# EAGLE design 04A-005 (EAGLE 9.6.2)
CIRCUIT_CATEGORY: CIRCUIT CATEGORY; CIRCUIT_VARIANT: CIRCUIT CATEGORY; LINE1: PRINTED CIRCUIT BOARD; LINE3: VARIANT; TITLE: TITLE
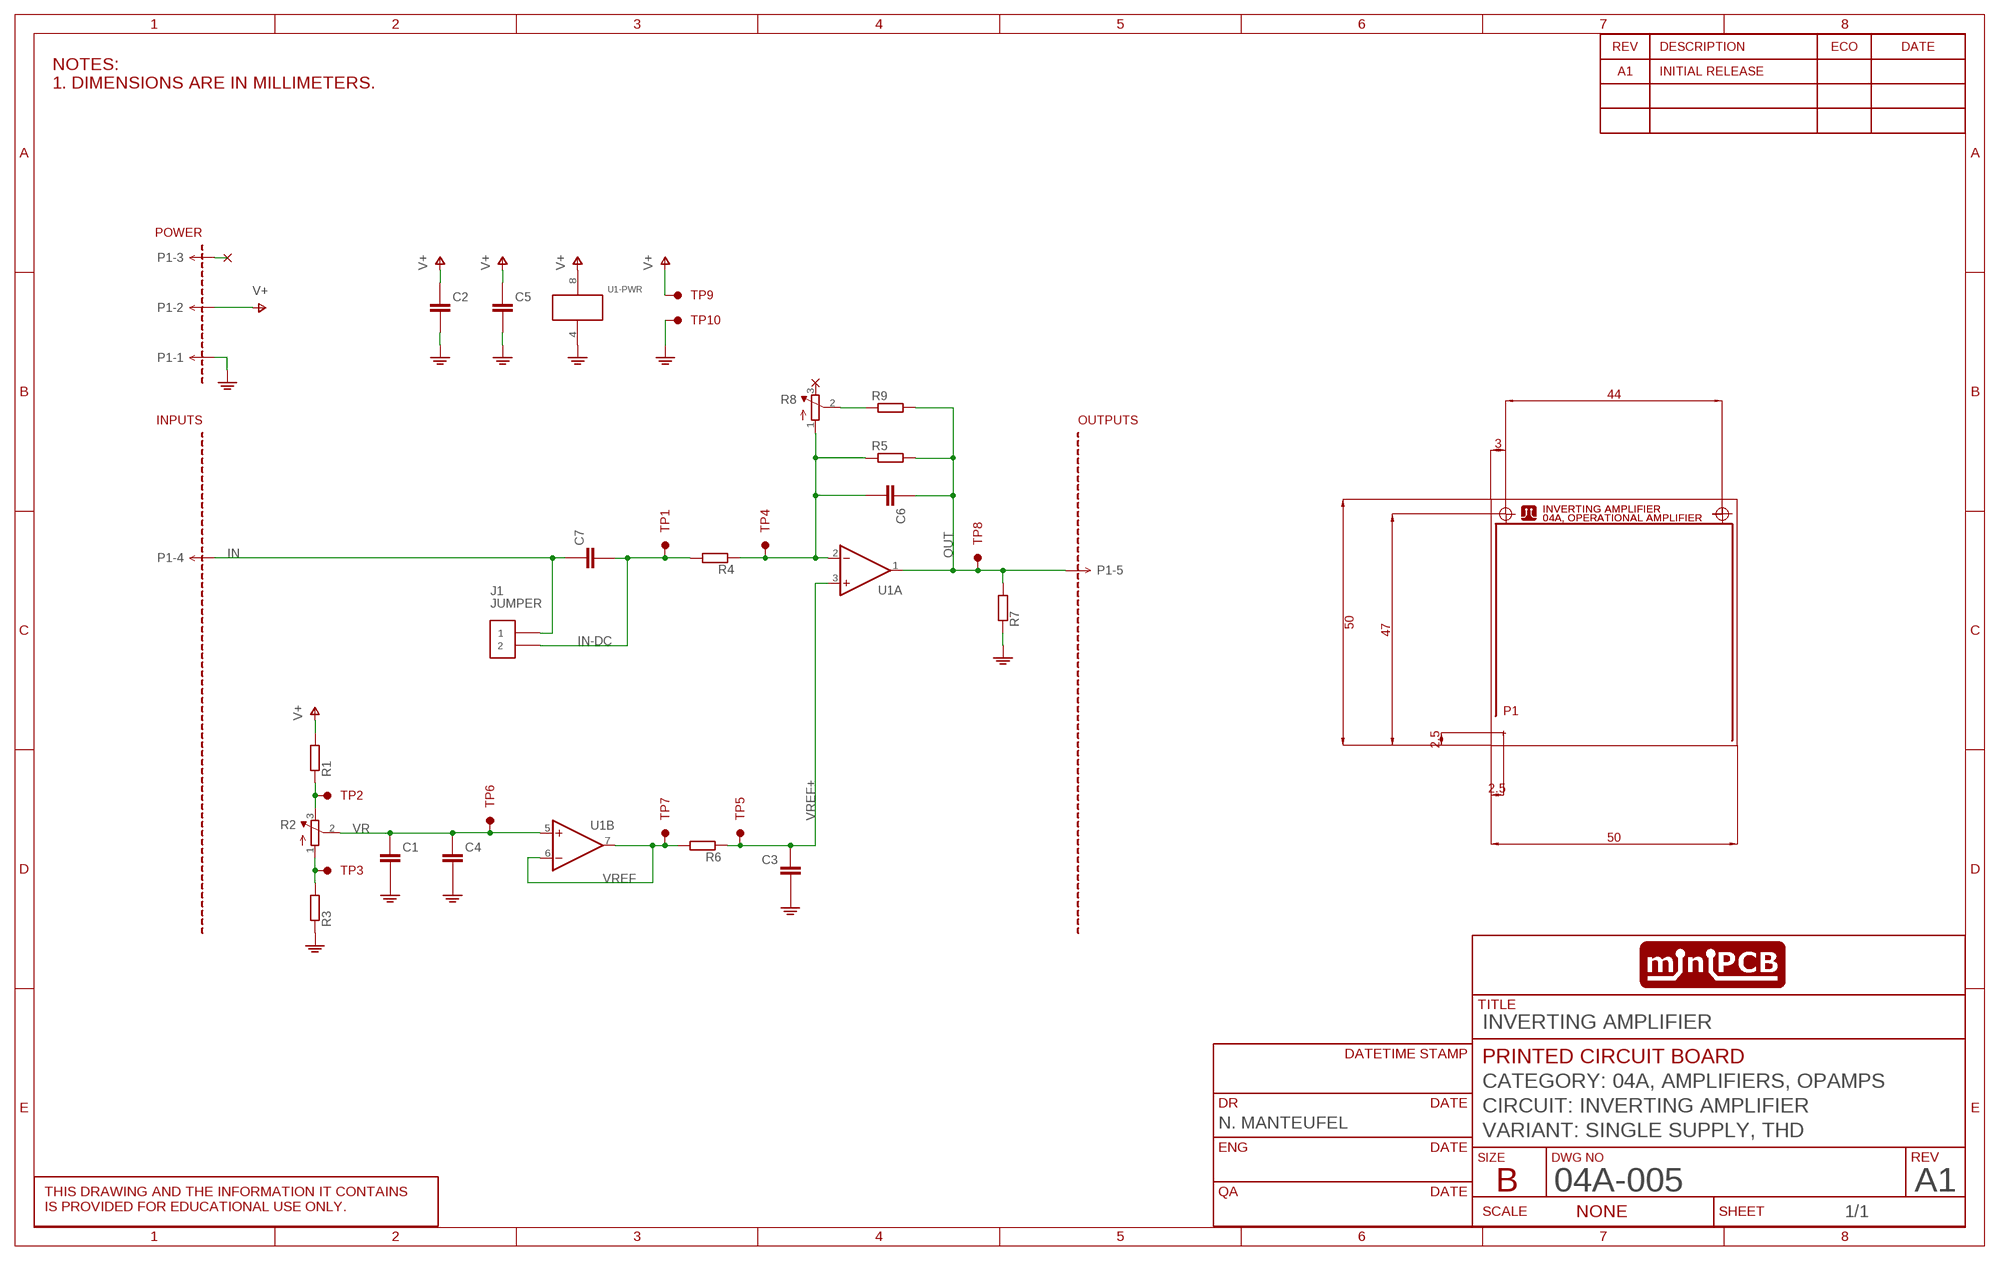
[diagram p0: schematic, sheet 1]
SHEET1 (SCHEMATIC): CIRCUIT_CATEGORY: CATEGORY: 04A, AMPLIFIERS, OPAMPS; CIRCUIT_NAME: CIRCUIT: INVERTING AMPLIFIER; CIRCUIT_VARIANT: VARIANT: SINGLE SUPPLY, THD; DR: N. MANTEUFEL; PCB_PCBA: PRINTED CIRCUIT BOARD; REVA: A1; REVISION: A1; TITLE: INVERTING AMPLIFIER

## Parts
C1  CAPACITOR_10  [C5MM]
C2  CAPACITORTHD  [C050-024X044]
C3  CAPACITORTHD  [C050-024X044]
C4  CAPACITORTHD  [C050-024X044]
C5  CAPACITOR_10  [C5MM]
C6  CAPACITORTHD  [C050-024X044]
C7  CAPACITORTHD  [C050-024X044]
J1  JUMPER  PINS_2  [PINS_2]
P1  MINIPCB_5P5P  [PINS_1X5]
R1  RESISTOR10MM  [0207/10]
R2  TRIMPOT0.100THD  [TRIM_0100]
R3  RESISTOR10MM  [0207/10]
R4  RESISTOR10MM  [0207/10]
R5  RESISTOR10MM  [0207/10]
R6  RESISTOR10MM  [0207/10]
R7  RESISTOR10MM  [0207/10]
R8  TRIMPOT0.100THD  [TRIM_0100]
R9  RESISTOR10MM  [0207/10]
TP1  TESTPOINTKE5000-SMTEXT  [PINS_1_TESTPOINT_KE5000_NOTEXT]
TP2  TESTPOINTKE5000-SMTEXT  [PINS_1_TESTPOINT_KE5000_NOTEXT]
TP3  TESTPOINTKE5000-SMTEXT  [PINS_1_TESTPOINT_KE5000_NOTEXT]
TP4  TESTPOINTKE5000-SMTEXT  [PINS_1_TESTPOINT_KE5000_NOTEXT]
TP5  TESTPOINTKE5000-SMTEXT  [PINS_1_TESTPOINT_KE5000_NOTEXT]
TP6  TESTPOINTKE5000-SMTEXT  [PINS_1_TESTPOINT_KE5000_NOTEXT]
TP7  TESTPOINTKE5000-SMTEXT  [PINS_1_TESTPOINT_KE5000_NOTEXT]
TP8  TESTPOINTKE5000-SMTEXT  [PINS_1_TESTPOINT_KE5000_NOTEXT]
TP9  TESTPOINTKE5000-SMTEXT  [PINS_1_TESTPOINT_KE5000_NOTEXT]
TP10  TESTPOINTKE5000-SMTEXT  [PINS_1_TESTPOINT_KE5000_NOTEXT]
U1  OPAMP_DUALTHD  [DIL08]
U$1  MINIPCB_50X50  [MINIPCB_0P_50X50MM]

## Nets
GND: C1.- C2.2(-) C3.2(-) C4.2(-) C5.- P1.1 R3.1 R7.1 TP10.1 U1.4(-PWR:V-)
IN: C7.1(+) J1.1 P1.4
IN-DC: C7.2(-) J1.2 R4.2 TP1.1
N$1: R8.2(S) R9.1
NC: P1.3
OUT: C6.1(+) P1.5 R5.2 R7.2 R9.2 TP8.1 U1.1(A:OUT)
P1.1: R2.1(A) R3.2 TP3.1
P1.3: R1.1 R2.3(E) TP2.1
V+: C2.1(+) C5.+ P1.2 R1.2 TP9.1 U1.8(-PWR:V+)
VFB: C6.2(-) R4.1 R5.1 R8.1(A) TP4.1 U1.2(A:-IN)
VR: C1.+ C4.1(+) R2.2(S) TP6.1 U1.5(B:+IN)
VREF: R6.2 TP7.1 U1.6(B:-IN) U1.7(B:OUT)
VREF+: C3.1(+) R6.1 TP5.1 U1.3(A:+IN)
Unconnected: R8.3(E)

## Notes on the sheet
- NOTES:
  1. DIMENSIONS ARE IN MILLIMETERS.

## Library data of the parts
C1-C7 = minipcb:CAPACITOR
J1 = minipcb:PINS_2
P1 = minipcb:MINIPCB_5P
R1 R3-R7 R9 = minipcb:RESISTOR
R2 R8 = minipcb:TRIMPOT: SMT trimmer potentiometer part number TC33X http://www.ladyada.net/library/eagle
TP1-TP10 = minipcb:TESTPOINT
U1 = minipcb:OPAMP_DUAL: OP AMP
U$1 = minipcb:MINIPCB_50X50; CIRCUIT_CATEGORY: 04A, OPERATIONAL AMPLIFIER; PART_NUMBER: 04A-005; REVISION: A1-01; TITLE: INVERTING AMPLIFIER

## Board
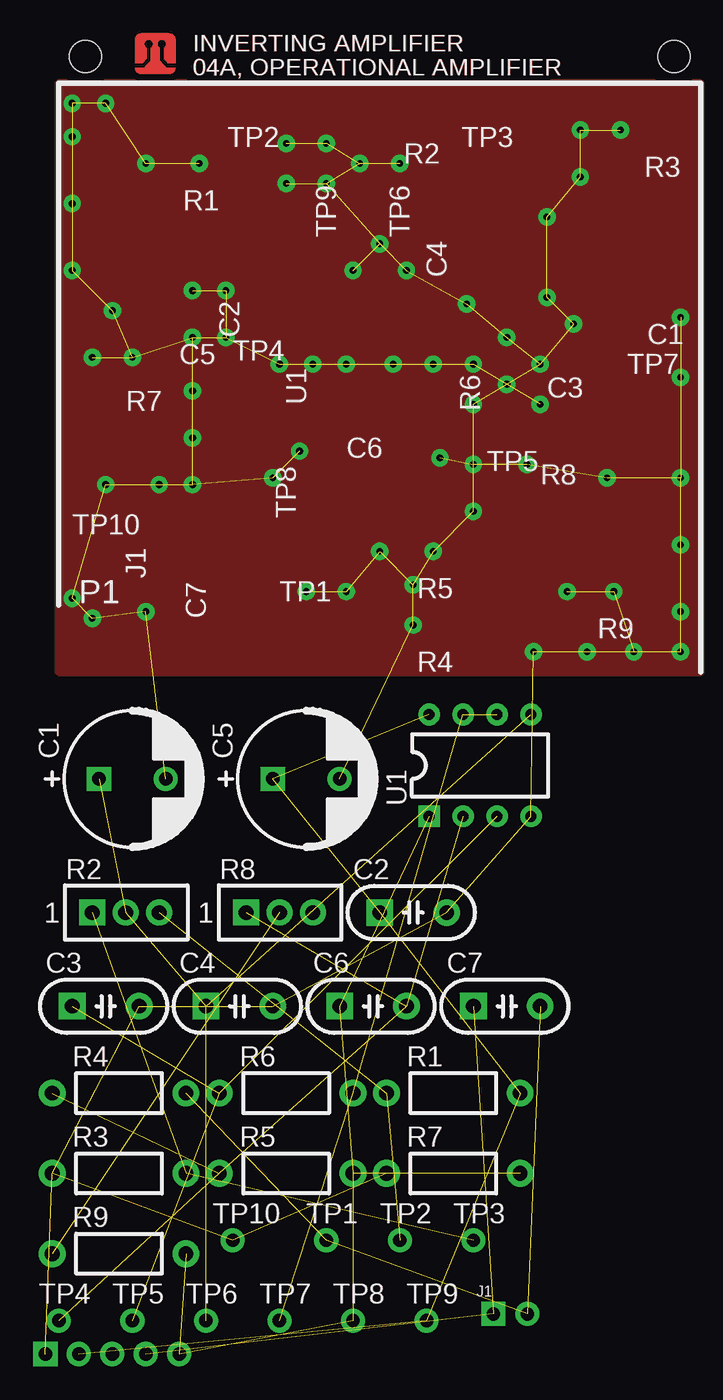
[diagram p1: board, top side]
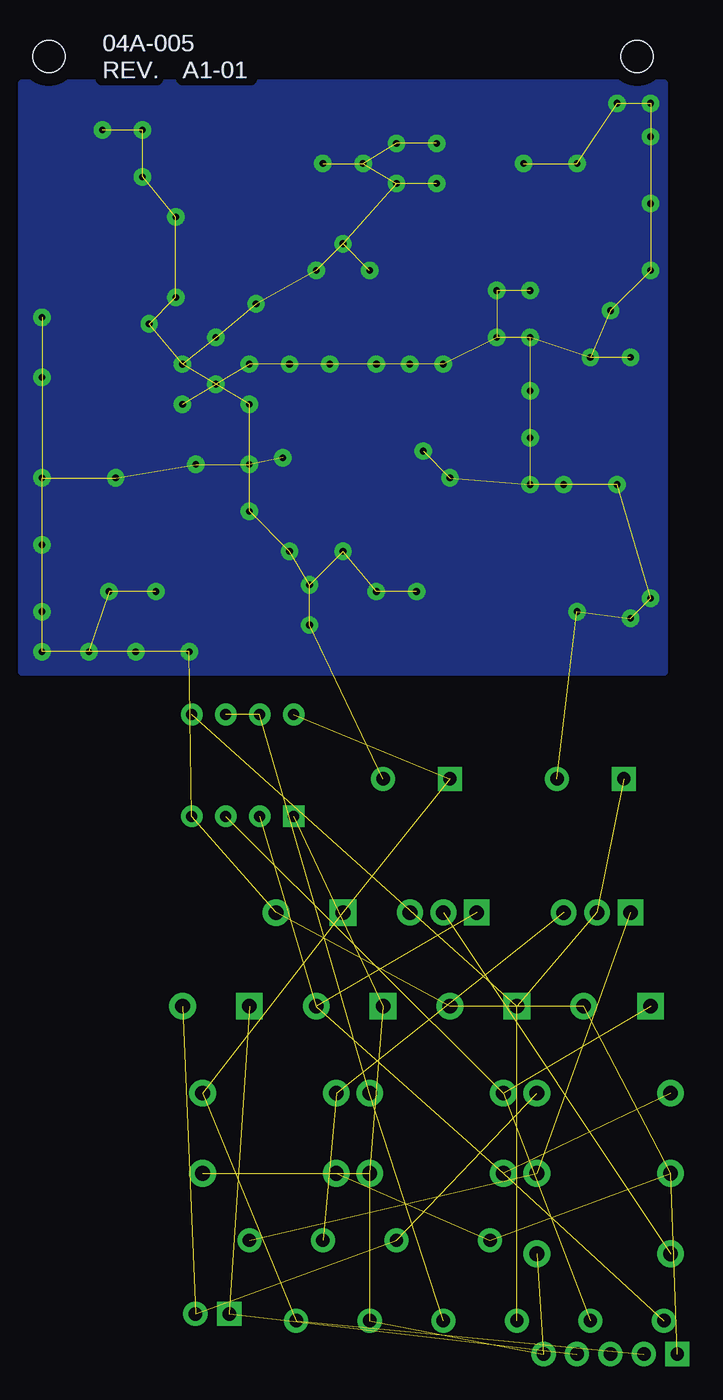
[diagram p2: board, bottom side, seen from below]

No outline drawn. Coordinates in mm, seen from the top.
Copper layers (1*16): Top 0.035mm / dielectric 1.5mm / Bottom 0.035mm
Design rules "minipcb-THD": minimum track width 0.5mm, minimum drill 0.5mm, track to track 0.5mm, track to pad 0.5mm, pad to pad 0.5mm, via to via 0.5mm, smd to smd 0mil, copper to edge 1mm, drill to drill 1mm, minimum pad ring 0.4mm, minimum via ring 0.4mm, stop-mask expansion 0.1mm, vias tented up to drill 0.6mm, thermal gap 0.5mm

### Footprints (pad centres in the part's own frame; a part is rotated, then mirrored left to right if it is on the bottom)
C5MM = drill 1 square: + -2.5,0 | drill 1: - 2.5,0
C050-024X044 = drill 1.1 pad 2 square: 1 -2.5,0 | drill 1.1 pad 2: 2 2.5,0
PINS_2 = drill 1 square: 1 0,0 | drill 1: 2 2.54,0
PINS_1X5 = drill 1 square: 1 0,0 | drill 1: 2 2.5,0; 3 5,0; 4 7.5,0; 5 10,0
0207/10 = drill 1.1 pad 2: 1 -5,0; 2 5,0
TRIM_0100 = drill 1.1 pad 1.93 square: 1 0,0 | drill 1.1 pad 1.93: 2 2.5,0; 3 5,0
PINS_1_TESTPOINT_KE5000_NOTEXT = drill 1: 1 0,0
DIL08 = drill 0.813 square: 1 -3.81,-3.81 | drill 0.813: 2 -1.27,-3.81; 3 1.27,-3.81; 4 3.81,-3.81; 5 3.81,3.81; 6 1.27,3.81; 7 -1.27,3.81; 8 -3.81,3.81
MINIPCB_0P_50X50MM = hole 2.4: 47,47; 3,47

### Placement (x,y rotation side)
C1  6.5,-7 0 top
C2  27.5,-17 0 top
C3  4.5,-24 0 top
C4  14.5,-24 0 top
C5  19.5,-7 0 top
C6  24.5,-24 0 top
C7  34.5,-24 0 top
J1  33.5,-47 0 top
P1  0,-50 0 top
R1  30.5,-30.5 0 top
R2  3.5,-17 0 top
R3  5.5,-36.5 0 top
R4  5.5,-30.5 0 top
R5  18,-36.5 0 top
R6  18,-30.5 0 top
R7  30.5,-36.5 0 top
R8  15,-17 0 top
R9  5.5,-42.5 0 top
TP1  21,-41.5 0 top
TP2  26.5,-41.5 0 top
TP3  32,-41.5 0 top
TP4  1,-47.5 0 top
TP5  6.5,-47.5 0 top
TP6  12,-47.5 0 top
TP7  17.5,-47.5 0 top
TP8  23,-47.5 0 top
TP9  28.5,-47.5 0 top
TP10  14,-41.5 0 top
U1  32.5,-6 0 top
U$1  0,0 0 top

### Tracks (layer width: path | path; a pad name or v marks a point on that pad's centre or on a via)
GND  (via drill 0.5)  (82 unrouted)
  other vias: 26,24 32,24 31.5,28.5 32,21 25,33 21,37.5 26.5,39 4.5,43.5 2,43.5 2,41 2,31 6.5,24.5 11,29.5 13.5,29.5 37.5,35 37.5,29 7.5,39 47.5,2.5 47.5,5.5 44,2.5 3.5,24.5 36,16.5 25,10 19,17.5 2,6.5 3.5,5 11.5,39 39.5,27 34.5,26 34.5,22.5 27.5,4.5 47.5,27.5 47.5,23 47.5,15.5 47.5,10.5 43,41.5 40,41.5 40,38 27.5,7.5 22.5,24 29,24 20,24 23,31 27,31 18,40.5 21,40.5 18,37.5 23.5,39 11,26 13.5,26 17.5,24 5,28 2,36 11,18.5 11,22 8.5,15 4.5,15 7.5,5.5 42,15.5 39,7 36.5,2.5 42.5,7 29,10 40.5,2.5 11,15 37,24 37,21 22.5,7 19.5,7 17,15.5 32,16.5 29.5,17 32,13
  pour Top: 1,1 49,1 49,45 1,45
  pour Bottom (isolate 0.3): 1,1 49,1 49,45 1,45
IN  (2 unrouted)
IN-DC  (3 unrouted)
N$1  (1 unrouted)
OUT  (6 unrouted)
P1.1  (2 unrouted)
P1.3  (2 unrouted)
V+  (5 unrouted)
VFB  (5 unrouted)
VR  (4 unrouted)
VREF  (3 unrouted)
VREF+  (3 unrouted)

### Text on the board
_tPlace: J1
_tNames: TP2 | TP3 | R2 | R3 | R1 | TP9 | TP6 | C4 | C2 | C1 | C5 | TP4 | TP7 | C3 | R7 | U1 | R6 | C6 | TP5 | R8 | TP8 | TP10 | R5 | TP1 | C7 | R9 | R4